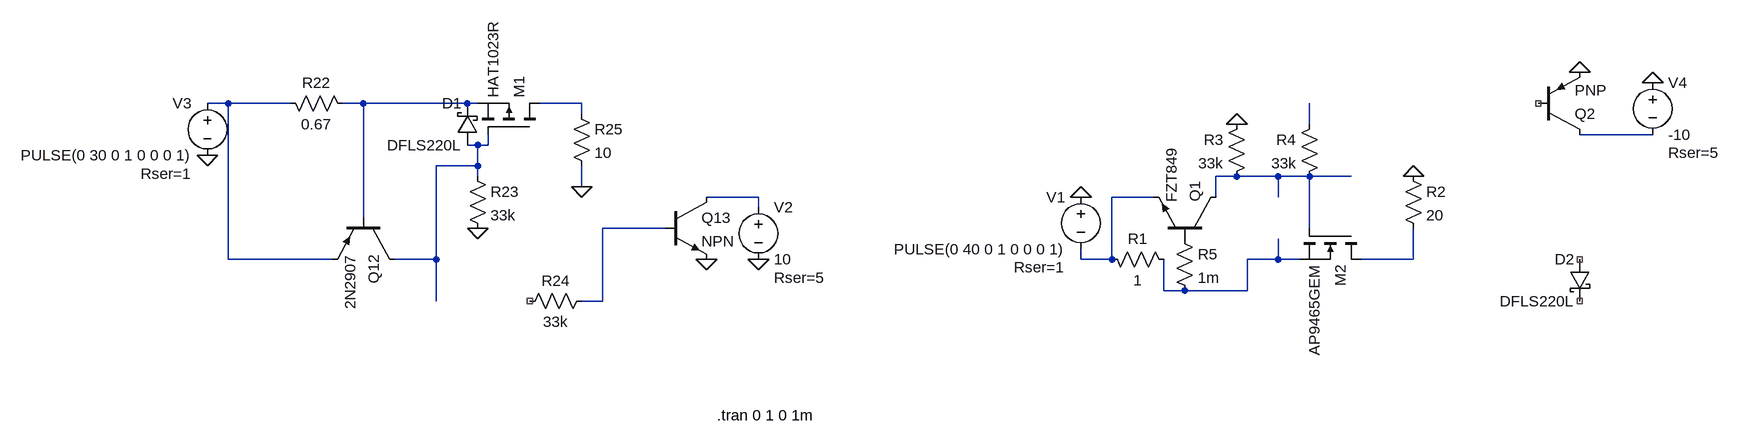
[diagram p0: schematic current_clamp.asc]
current_clamp.asc, the LTspice schematic file:
Version 4
SHEET 1 1428 692
WIRE -2192 176 -2224 176
WIRE -2096 176 -2192 176
WIRE -1984 176 -2016 176
WIRE -1824 176 -1984 176
WIRE -1808 176 -1824 176
WIRE -1648 176 -1712 176
WIRE -1648 192 -1648 176
WIRE -528 208 -528 176
WIRE 0 224 -112 224
WIRE -1808 240 -1824 240
WIRE -1792 240 -1792 224
WIRE -1792 240 -1808 240
WIRE -1808 272 -1808 240
WIRE -1808 272 -1872 272
WIRE -1808 288 -1808 272
WIRE -640 288 -672 288
WIRE -576 288 -640 288
WIRE -528 288 -576 288
WIRE -464 288 -528 288
WIRE -1648 304 -1648 272
WIRE -1376 320 -1456 320
WIRE -768 320 -832 320
WIRE -672 320 -672 288
WIRE -576 320 -576 288
WIRE -1376 336 -1376 320
WIRE -1984 352 -1984 176
WIRE -1520 368 -1616 368
WIRE -528 368 -528 288
WIRE -2192 416 -2192 176
WIRE -2032 416 -2192 416
WIRE -1872 416 -1872 272
WIRE -1872 416 -1936 416
WIRE -880 416 -880 400
WIRE -832 416 -832 320
WIRE -832 416 -880 416
WIRE -576 416 -576 384
WIRE -576 416 -624 416
WIRE -544 416 -576 416
WIRE -368 416 -368 368
WIRE -368 416 -448 416
WIRE -752 464 -752 416
WIRE -720 464 -752 464
WIRE -624 464 -624 416
WIRE -624 464 -720 464
WIRE -1872 480 -1872 416
WIRE -1616 480 -1616 368
WIRE -1616 480 -1648 480
FLAG -1648 304 0
FLAG -1808 368 0
FLAG -1456 416 0
FLAG -1376 416 0
FLAG -2224 256 0
FLAG -880 320 0
FLAG -368 288 0
FLAG -640 208 0
FLAG -112 128 0
FLAG 0 144 0
SYMBOL pmos -1712 224 M270
SYMATTR InstName M1
SYMATTR Value HAT1023R
SYMBOL res -1664 176 R0
SYMATTR InstName R25
SYMATTR Value 10
SYMBOL res -2112 160 M90
WINDOW 0 0 56 VBottom 2
WINDOW 3 32 56 VTop 2
SYMATTR InstName R22
SYMATTR Value 0.67
SYMBOL pnp -1936 352 R90
SYMATTR InstName Q12
SYMATTR Value 2N2907
SYMBOL res -1824 272 R0
SYMATTR InstName R23
SYMATTR Value 33k
SYMBOL schottky -1808 240 R180
WINDOW 0 24 64 Left 2
WINDOW 3 24 0 Left 2
SYMATTR InstName D1
SYMATTR Value DFLS220L
SYMATTR Description Zener Diode
SYMATTR Type zener
SYMBOL npn -1520 320 R0
SYMATTR InstName Q13
SYMBOL voltage -1376 320 R0
WINDOW 123 0 0 Left 0
WINDOW 39 24 124 Left 2
SYMATTR SpiceLine Rser=5
SYMATTR InstName V2
SYMATTR Value 10
SYMBOL res -1632 464 R90
WINDOW 0 0 56 VBottom 2
WINDOW 3 32 56 VTop 2
SYMATTR InstName R24
SYMATTR Value 33k
SYMBOL voltage -2224 160 M0
WINDOW 123 0 0 Left 0
WINDOW 39 24 124 Left 2
SYMATTR SpiceLine Rser=1
SYMATTR InstName V3
SYMATTR Value PULSE(0 30 0 1 0 0 0 1)
SYMBOL voltage -880 304 M0
WINDOW 123 0 0 Left 0
WINDOW 39 24 124 Left 2
SYMATTR SpiceLine Rser=1
SYMATTR InstName V1
SYMATTR Value PULSE(0 40 0 1 0 0 0 1)
SYMBOL res -848 400 M90
WINDOW 0 0 56 VBottom 2
WINDOW 3 32 56 VTop 2
SYMATTR InstName R1
SYMATTR Value 1
SYMBOL npn -672 384 M270
SYMATTR InstName Q1
SYMATTR Value FZT849
SYMBOL schottky -96 416 M0
SYMATTR InstName D2
SYMATTR Value DFLS220L
SYMATTR Description Zener Diode
SYMATTR Type zener
SYMBOL nmos -448 368 R90
SYMATTR InstName M2
SYMATTR Value AP9465GEM
SYMBOL res -384 272 R0
SYMATTR InstName R2
SYMATTR Value 20
SYMBOL res -624 192 M0
SYMATTR InstName R3
SYMATTR Value 33k
SYMBOL res -512 192 M0
SYMATTR InstName R4
SYMATTR Value 33k
SYMBOL pnp -176 224 M180
SYMATTR InstName Q2
SYMBOL voltage 0 128 R0
WINDOW 123 0 0 Left 0
WINDOW 39 24 124 Left 2
SYMATTR SpiceLine Rser=5
SYMATTR InstName V4
SYMATTR Value -10
SYMBOL res -736 368 R0
SYMATTR InstName R5
SYMATTR Value 1m
TEXT -1440 656 Left 2 !.tran 0 1 0 1m

The netlist it stands for:
* current_clamp.asc
M1 N003 N006 N002 N002 HAT1023R
R25 N003 0 10
R22 N001 N002 0.67
Q12 N006 N002 N001 0 2N2907
R23 N006 0 33k
D1 N006 N002 DFLS220L
Q13 N008 N010 0 0 NPN
V2 N008 0 10 Rser=5
R24 N010 NC_01 33k
V3 N001 0 PULSE(0 30 0 1 0 0 0 1) Rser=1
V1 0 N009 PULSE(0 40 0 1 0 0 0 1) Rser=1
R1 N009 N011 1
Q1 N007 P001 N009 0 FZT849
D2 NC_02 NC_03 DFLS220L
M2 N012 N007 N011 N011 AP9465GEM
R2 0 N012 20
R3 0 N007 33k
R4 N004 N007 33k
Q2 N005 NC_04 0 0 PNP
V4 0 N005 -10 Rser=5
R5 P001 N011 1m
.model D D
.lib standard.dio
.model NPN NPN
.model PNP PNP
.lib standard.bjt
.model NMOS NMOS
.model PMOS PMOS
.lib standard.mos
.tran 0 1 0 1m
.backanno
.end